# EAGLE design breakoutbrd (EAGLE 9.6.2)
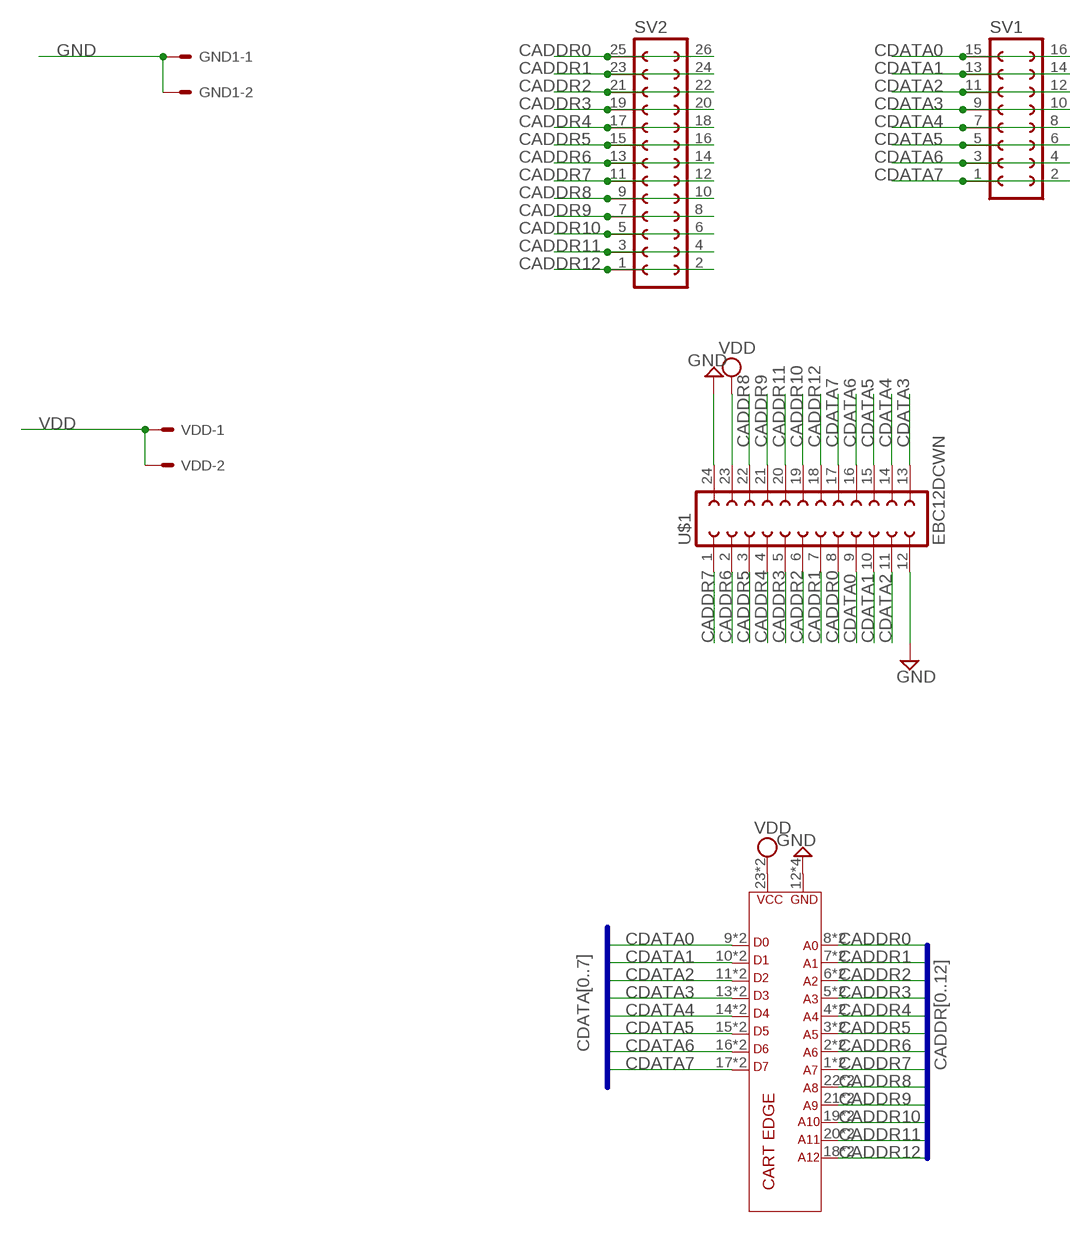
[diagram p0: schematic, sheet 1]

## Parts
GND1  22-23-2021  [22-23-2021]
J1  ATARI-2600  [BREAKOUT_BOARD]
SV1  FE08-2  [FE08-2]
SV2  FE13-2  [FE13-2]
U$1  EBC12DCWN  [EBC12DCWN]
VDD  22-23-2021  [22-23-2021]

## Nets
CADDR0: J1.8(A0) J1.32(A0) SV2.25 SV2.26 U$1.8
CADDR1: J1.7(A1) J1.31(A1) SV2.23 SV2.24 U$1.7
CADDR2: J1.6(A2) J1.30(A2) SV2.21 SV2.22 U$1.6
CADDR3: J1.5(A3) J1.29(A3) SV2.19 SV2.20 U$1.5
CADDR4: J1.4(A4) J1.28(A4) SV2.17 SV2.18 U$1.4
CADDR5: J1.3(A5) J1.27(A5) SV2.15 SV2.16 U$1.3
CADDR6: J1.2(A6) J1.26(A6) SV2.13 SV2.14 U$1.2
CADDR7: J1.1(A7) J1.25(A7) SV2.11 SV2.12 U$1.1
CADDR8: J1.22(A8) J1.46(A8) SV2.9 SV2.10 U$1.22
CADDR9: J1.21(A9) J1.45(A9) SV2.7 SV2.8 U$1.21
CADDR10: J1.19(A10) J1.43(A10) SV2.5 SV2.6 U$1.19
CADDR11: J1.20(A11) J1.44(A11) SV2.3 SV2.4 U$1.20
CADDR12: J1.18(A12) J1.42(A12) SV2.1 SV2.2 U$1.18
CDATA0: J1.9(D0) J1.33(D0) SV1.15 SV1.16 U$1.9
CDATA1: J1.10(D1) J1.34(D1) SV1.13 SV1.14 U$1.10
CDATA2: J1.11(D2) J1.35(D2) SV1.11 SV1.12 U$1.11
CDATA3: J1.13(D3) J1.37(D3) SV1.9 SV1.10 U$1.13
CDATA4: J1.14(D4) J1.38(D4) SV1.7 SV1.8 U$1.14
CDATA5: J1.15(D5) J1.39(D5) SV1.5 SV1.6 U$1.15
CDATA6: J1.16(D6) J1.40(D6) SV1.3 SV1.4 U$1.16
CDATA7: J1.17(D7) J1.41(D7) SV1.1 SV1.2 U$1.17
GND: GND1.1 GND1.2 J1.12(GND) J1.24(GND) J1.36(GND) J1.48(GND) U$1.12 U$1.24
VDD: J1.23(VCC) J1.47(VCC) U$1.23 VDD.1 VDD.2

## Buses
CADDR[0..12]
CDATA[0..7]

## Library data of the parts
GND1 VDD = a26board:22-23-2021: .100" (2.54mm) Center Header - 2 Pin; MF: MOLEX; MPN: 22-23-2021; OC_FARNELL: 1462926; OC_NEWARK: 25C3832
J1 = a26board:ATARI-2600: Atari 2600 cartridge board
SV1 = a26board:FE08-2: FEMALE HEADER; OC_FARNELL: unknown; OC_NEWARK: unknown
SV2 = a26board:FE13-2: FEMALE HEADER; OC_FARNELL: unknown; OC_NEWARK: unknown
U$1 = a26board:EBC12DCWN: EBC12DCWN Dual row female edge connector 0.1" spacing 0.2" between rows

## Board
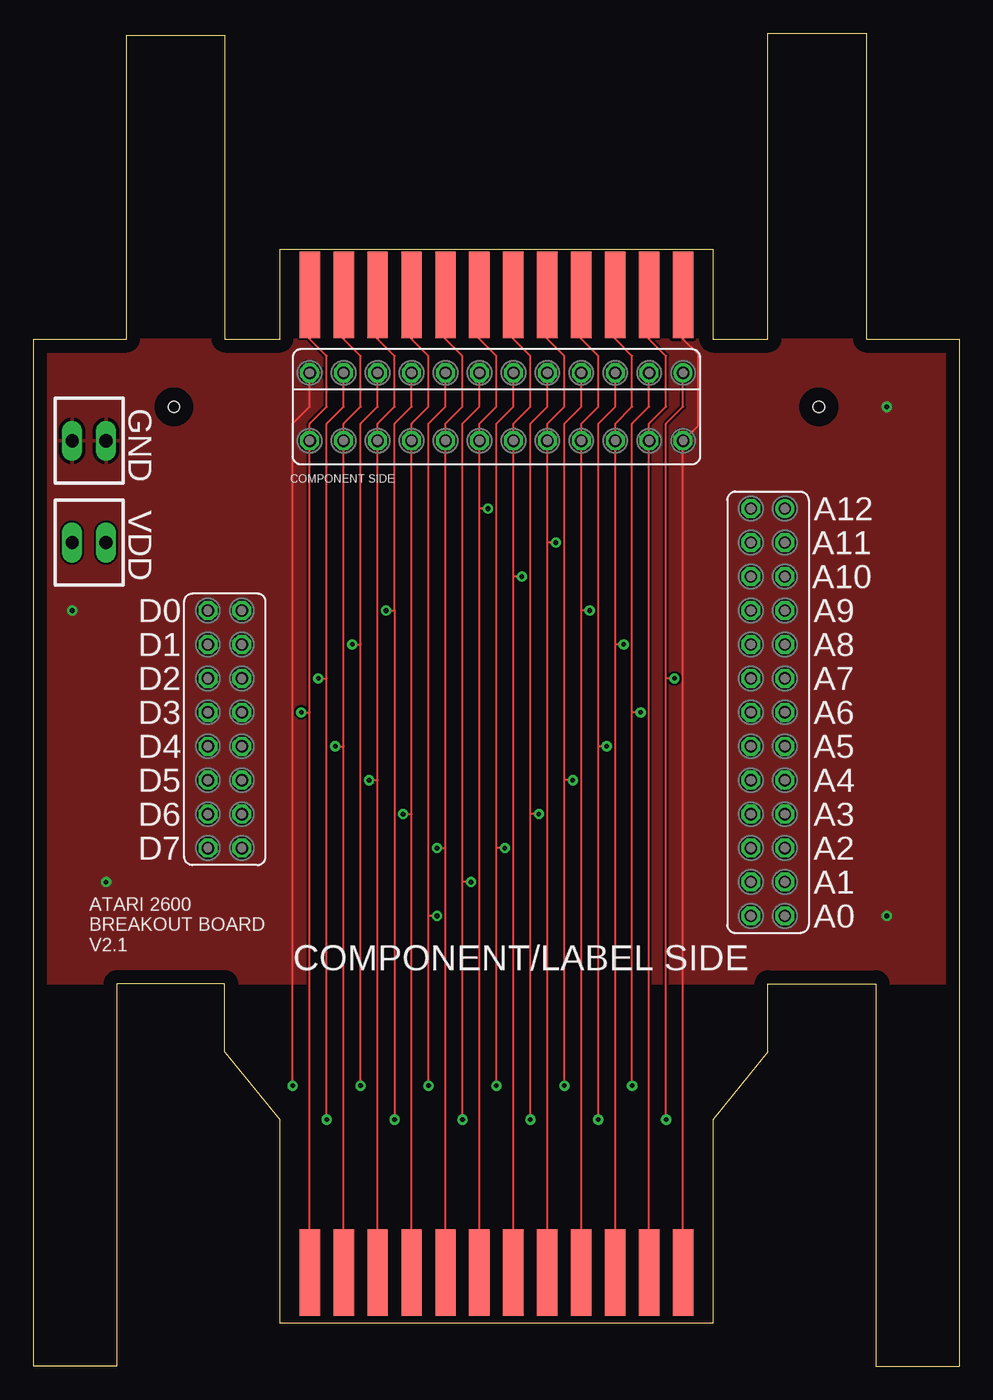
[diagram p1: board, top side]
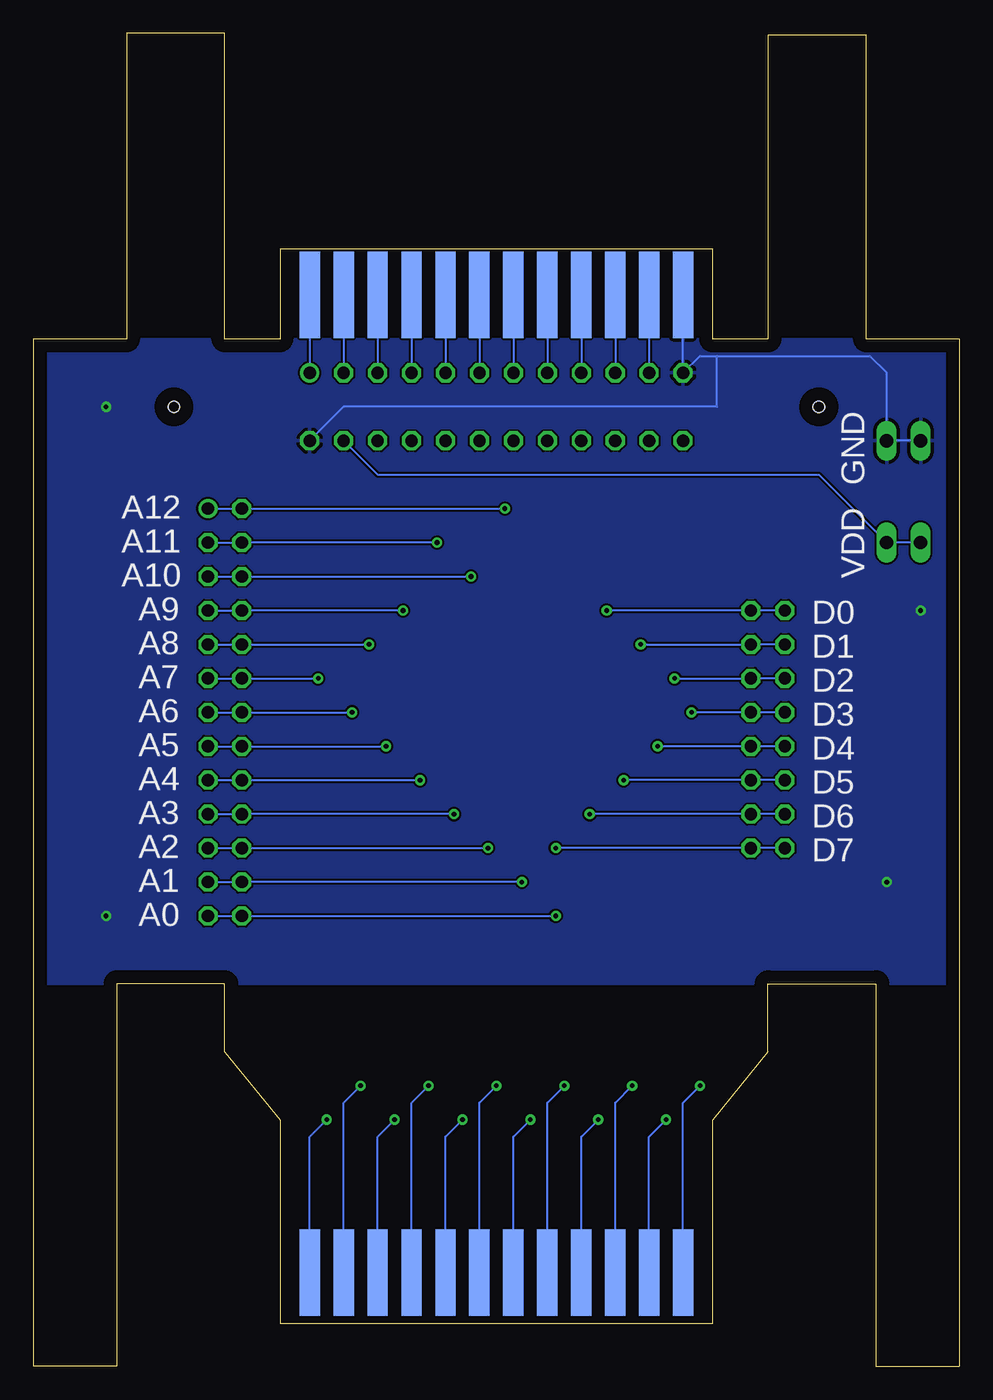
[diagram p2: board, bottom side, seen from below]

Size 69.3 x 99.72 mm. Coordinates in mm from the lower left corner, seen from the top.
Copper layers (1*16): Top 0.035mm / dielectric 1.5mm / Bottom 0.035mm
Design rules "default": minimum track width 6mil, minimum drill 0.35mm, track to track 6mil, track to pad 6mil, pad to pad 6mil, via to via 6mil, smd to smd 6mil, copper to edge 40mil, drill to drill 6mil, minimum pad ring 10mil, minimum via ring 8mil, stop-mask expansion 4mil, vias tented up to drill 0mil, thermal gap 10mil
Holes 0.85 mm at 10.52,71.78 58.78,71.78

### Footprints (pad centres in the part's own frame; a part is rotated, then mirrored left to right if it is on the bottom)
22-23-2021 = drill 1 long: 1 -1.27,0; 2 1.27,0
BREAKOUT_BOARD = smd 1.524 x 6.477: 1 -13.97,-46.99; 2 -11.43,-46.99; 3 -8.89,-46.99; 4 -6.35,-46.99; 5 -3.81,-46.99; 6 -1.27,-46.99; 7 1.27,-46.99; 8 3.81,-46.99; 9 6.35,-46.99; 10 8.89,-46.99; 11 11.43,-46.99; 12 13.97,-46.99; 25 -13.97,26.162; 26 -11.43,26.162; 27 -8.89,26.162; 28 -6.35,26.162; 29 -3.81,26.162; 30 -1.27,26.162; 31 1.27,26.162; 32 3.81,26.162; 33 6.35,26.162; 34 8.89,26.162; 35 11.43,26.162; 36 13.97,26.162 | smd 1.524 x 6.477 bottom: 13 13.97,-46.99; 14 11.43,-46.99; 15 8.89,-46.99; 16 6.35,-46.99; 17 3.81,-46.99; 18 1.27,-46.99; 19 -1.27,-46.99; 20 -3.81,-46.99; 21 -6.35,-46.99; 22 -8.89,-46.99; 23 -11.43,-46.99; 24 -13.97,-46.99; 37 13.97,26.162; 38 11.43,26.162; 39 8.89,26.162; 40 6.35,26.162; 41 3.81,26.162; 42 1.27,26.162; 43 -1.27,26.162; 44 -3.81,26.162; 45 -6.35,26.162; 46 -8.89,26.162; 47 -11.43,26.162; 48 -13.97,26.162
FE08-2 = drill 0.914 octagon: 1 -8.89,1.27; 2 -8.89,-1.27; 3 -6.35,1.27; 4 -6.35,-1.27; 5 -3.81,1.27; 6 -3.81,-1.27; 7 -1.27,1.27; 8 -1.27,-1.27; 9 1.27,1.27; 10 1.27,-1.27; 11 3.81,1.27; 12 3.81,-1.27; 13 6.35,1.27; 14 6.35,-1.27; 15 8.89,1.27; 16 8.89,-1.27
FE13-2 = drill 0.914: 1 -15.24,1.27 | drill 0.914 octagon: 2 -15.24,-1.27; 3 -12.7,1.27; 4 -12.7,-1.27; 5 -10.16,1.27; 6 -10.16,-1.27; 7 -7.62,1.27; 8 -7.62,-1.27; 9 -5.08,1.27; 10 -5.08,-1.27; 11 -2.54,1.27; 12 -2.54,-1.27; 13 0,1.27; 14 0,-1.27; 15 2.54,1.27; 16 2.54,-1.27; 17 5.08,1.27; 18 5.08,-1.27; 19 7.62,1.27; 20 7.62,-1.27; 21 10.16,1.27; 22 10.16,-1.27; 23 12.7,1.27; 24 12.7,-1.27; 25 15.24,1.27; 26 15.24,-1.27
EBC12DCWN = drill 0.914: 1 -13.97,-2.54 | drill 0.914 octagon: 2 -11.43,-2.54; 3 -8.89,-2.54; 4 -6.35,-2.54; 5 -3.81,-2.54; 6 -1.27,-2.54; 7 1.27,-2.54; 8 3.81,-2.54; 9 6.35,-2.54; 10 8.89,-2.54; 11 11.43,-2.54; 12 13.97,-2.54; 13 13.97,2.54; 14 11.43,2.54; 15 8.89,2.54; 16 6.35,2.54; 17 3.81,2.54; 18 1.27,2.54; 19 -1.27,2.54; 20 -3.81,2.54; 21 -6.35,2.54; 22 -8.89,2.54; 23 -11.43,2.54; 24 -13.97,2.54

### Placement (x,y rotation side)
GND1  4.17,69.24 0 top
J1  34.65,54 0 bottom
SV1  14.33,47.65 90 top
SV2  54.97,48.92 270 top
U$1  34.65,71.78 180 top
VDD  4.17,61.62 0 top

### Tracks (layer width: path | path; a pad name or v marks a point on that pad's centre or on a via)
CADDR0  (via drill 0.35)
  Top 0.152: U$1.8 30.84,71.78 29.57,70.51 29.57,33.68 | v29.57,20.98 29.57,33.68 | v30.2,33.68 29.57,33.68
  Bottom 0.152: J1.8 30.84,19.71 v29.57,20.98 | SV2.25 SV2.26 v30.2,33.68 | J1.32 U$1.8
CADDR1  (via drill 0.35)
  Top 0.152: U$1.7 33.38,71.78 32.11,70.51 32.11,36.22 | v32.11,18.44 32.11,36.22 | v32.74,36.22 32.11,36.22
  Bottom 0.152: J1.7 33.38,17.17 v32.11,18.44 | SV2.23 SV2.24 v32.74,36.22 | J1.31 U$1.7
CADDR2  (via drill 0.35)
  Top 0.152: U$1.6 35.92,71.78 34.65,70.51 34.65,38.76 | v34.65,20.98 34.65,38.76 | v35.29,38.76 34.65,38.76
  Bottom 0.152: J1.6 35.92,19.71 v34.65,20.98 | SV2.21 SV2.22 v35.29,38.76 | J1.30 U$1.6
CADDR3  (via drill 0.35)
  Top 0.152: U$1.5 38.46,71.78 37.19,70.51 37.19,41.3 | v37.19,18.44 37.19,41.3 | v37.83,41.3 37.19,41.3
  Bottom 0.152: J1.5 38.46,17.17 v37.19,18.44 | SV2.19 SV2.20 v37.83,41.3 | J1.29 U$1.5
CADDR4  (via drill 0.35)
  Top 0.152: U$1.4 41,71.78 39.73,70.51 39.73,43.84 | v39.73,20.98 39.73,43.84 | v40.37,43.84 39.73,43.84
  Bottom 0.152: J1.4 41,19.71 v39.73,20.98 | SV2.17 SV2.18 v40.37,43.84 | J1.28 U$1.4
CADDR5  (via drill 0.35)
  Top 0.152: U$1.3 43.54,71.78 42.27,70.51 42.27,46.38 | v42.27,18.44 42.27,46.38 | v42.91,46.38 42.27,46.38
  Bottom 0.152: J1.3 43.54,17.17 v42.27,18.44 | SV2.15 SV2.16 v42.91,46.38 | J1.27 U$1.3
CADDR6  (via drill 0.35)
  Top 0.152: U$1.2 46.08,71.78 44.81,70.51 44.81,48.92 | v44.81,20.98 44.81,48.92 | v45.45,48.92 44.81,48.92
  Bottom 0.152: J1.2 46.08,19.71 v44.81,20.98 | SV2.13 SV2.14 v45.45,48.92 | J1.26 U$1.2
CADDR7  (via drill 0.35)
  Top 0.152: U$1.1 48.62,71.78 47.35,70.51 47.35,51.46 | v47.35,18.44 47.35,51.46 | v47.98,51.46 47.35,51.46
  Bottom 0.152: J1.1 48.62,17.17 v47.35,18.44 | SV2.11 SV2.12 v47.98,51.46 | J1.25 U$1.1
CADDR8  (via drill 0.35)
  Top 0.152: J1.22 43.54,54 | 43.54,54 U$1.22 43.54,70.51 44.81,71.78 44.81,75.59 43.54,76.86 J1.46 | v44.17,54 43.54,54
  Bottom 0.152: SV2.9 SV2.10 v44.17,54
CADDR9  (via drill 0.35)
  Top 0.152: J1.21 41,56.54 | 41,56.54 U$1.21 41,70.51 42.27,71.78 42.27,75.59 41,76.86 J1.45 | v41.63,56.54 41,56.54
  Bottom 0.152: SV2.7 SV2.8 v41.63,56.54
CADDR10  (via drill 0.35)
  Top 0.152: J1.19 35.92,59.08 | 35.92,59.08 U$1.19 35.92,70.51 37.19,71.78 37.19,75.59 35.92,76.86 J1.43 | v36.55,59.08 35.92,59.08
  Bottom 0.152: SV2.5 SV2.6 v36.55,59.08
CADDR11  (via drill 0.35)
  Top 0.152: J1.20 38.46,61.62 | 38.46,61.62 U$1.20 38.46,70.51 39.73,71.78 39.73,75.59 38.46,76.86 J1.44 | v39.09,61.62 38.46,61.62
  Bottom 0.152: SV2.3 SV2.4 v39.09,61.62
CADDR12  (via drill 0.35)
  Top 0.152: J1.18 33.38,64.16 | 33.38,64.16 U$1.18 33.38,70.51 34.65,71.78 34.65,75.59 33.38,76.86 J1.42 | v34.02,64.16 33.38,64.16
  Bottom 0.152: SV2.1 SV2.2 v34.02,64.16
CDATA0  (via drill 0.35)
  Top 0.152: U$1.9 28.3,71.78 27.03,70.51 27.03,56.54 | v26.39,56.54 27.03,56.54 | 27.03,56.54 v27.03,18.44
  Bottom 0.152: J1.9 28.3,17.17 v27.03,18.44 | SV1.15 SV1.16 v26.39,56.54 | J1.33 U$1.9
CDATA1  (via drill 0.35)
  Top 0.152: U$1.10 25.76,71.78 24.49,70.51 24.49,54 | v24.49,20.98 24.49,54 | v23.86,54 24.49,54
  Bottom 0.152: J1.10 25.76,19.71 v24.49,20.98 | SV1.13 SV1.14 v23.86,54 | J1.34 U$1.10
CDATA2  (via drill 0.35)
  Top 0.152: v21.95,18.44 21.95,51.46 | 21.95,51.46 21.95,70.51 23.22,71.78 U$1.11 | v21.32,51.46 21.95,51.46
  Bottom 0.152: J1.11 23.22,17.17 v21.95,18.44 | SV1.11 SV1.12 v21.32,51.46 | J1.35 U$1.11
CDATA3  (via drill 0.35)
  Top 0.152: J1.13 20.68,48.92 | 20.68,48.92 U$1.13 20.68,70.51 21.95,71.78 21.95,75.59 20.68,76.86 J1.37 | v20.05,48.92 20.68,48.92
  Bottom 0.152: SV1.9 SV1.10 v20.05,48.92
CDATA4  (via drill 0.35)
  Top 0.152: J1.14 23.22,46.38 | 23.22,46.38 U$1.14 23.22,70.51 24.49,71.78 24.49,75.59 23.22,76.86 J1.38 | v22.59,46.38 23.22,46.38
  Bottom 0.152: SV1.7 SV1.8 v22.59,46.38
CDATA5  (via drill 0.35)
  Top 0.152: J1.15 25.76,43.84 | 25.76,43.84 U$1.15 25.76,70.51 27.03,71.78 27.03,75.59 25.76,76.86 J1.39 | v25.12,43.84 25.76,43.84
  Bottom 0.152: SV1.5 SV1.6 v25.12,43.84
CDATA6  (via drill 0.35)
  Top 0.152: J1.16 28.3,41.3 | 28.3,41.3 U$1.16 28.3,70.51 29.57,71.78 29.57,75.59 28.3,76.86 J1.40 | v27.66,41.3 28.3,41.3
  Bottom 0.152: SV1.3 SV1.4 v27.66,41.3
CDATA7  (via drill 0.35)
  Top 0.152: J1.17 30.84,38.76 | 30.84,38.76 U$1.17 30.84,70.51 32.11,71.78 32.11,75.59 30.84,76.86 J1.41 | v30.2,38.76 30.84,38.76
  Bottom 0.152: SV1.1 SV1.2 v30.2,38.76
GND  (via drill 0.35)
  Top 0.152: J1.24 U$1.24 49.75,70.37 49.75,75.73 48.62,76.86 J1.48 | U$1.12 20.68,71.78 19.41,70.51 v19.41,20.98
  Bottom 0.152: J1.12 20.68,19.71 v19.41,20.98 | GND1.1 GND1.2 5.44,74.32 6.71,75.59 18.14,75.59 | J1.36 U$1.12 19.41,75.59 18.14,75.59 | U$1.24 46.08,71.78 18.14,71.78 18.14,75.59
  other vias: 2.9,56.54 5.44,36.22 63.86,71.78 63.86,33.68
  pour Bottom: -2.18,28.6 -2.18,76.86 71.48,76.86 71.48,28.6
  pour Top: -2.18,28.6 -2.18,76.86 71.48,76.86 71.48,28.6
VDD
  Top 0.152: J1.23 U$1.23 46.08,70.51 47.35,71.78 47.35,75.59 46.08,76.86 J1.47
  Bottom 0.152: U$1.23 43.54,66.7 10.52,66.7 VDD.2 VDD.1

### Text on the board
tPlace: GND | A12 | VDD | A11 | A10 | A9 | D0 | A8 | D1 | A7 | D2 | A6 | D3 | A5 | D4 | A4 | D5 | A3 | D6 | A2 | D7 | A1 | A0 | ATARI 2600 / BREAKOUT BOARD / V2.1 | COMPONENT/LABEL SIDE
bPlace: GND | A12 | A11 | VDD | A10 | D0 | A9 | D1 | A8 | D2 | A7 | D3 | A6 | D4 | A5 | D5 | A4 | D6 | A3 | D7 | A2 | A1 | A0